# EAGLE schematic Main_f (EAGLE 6.4)
REV: 1.0
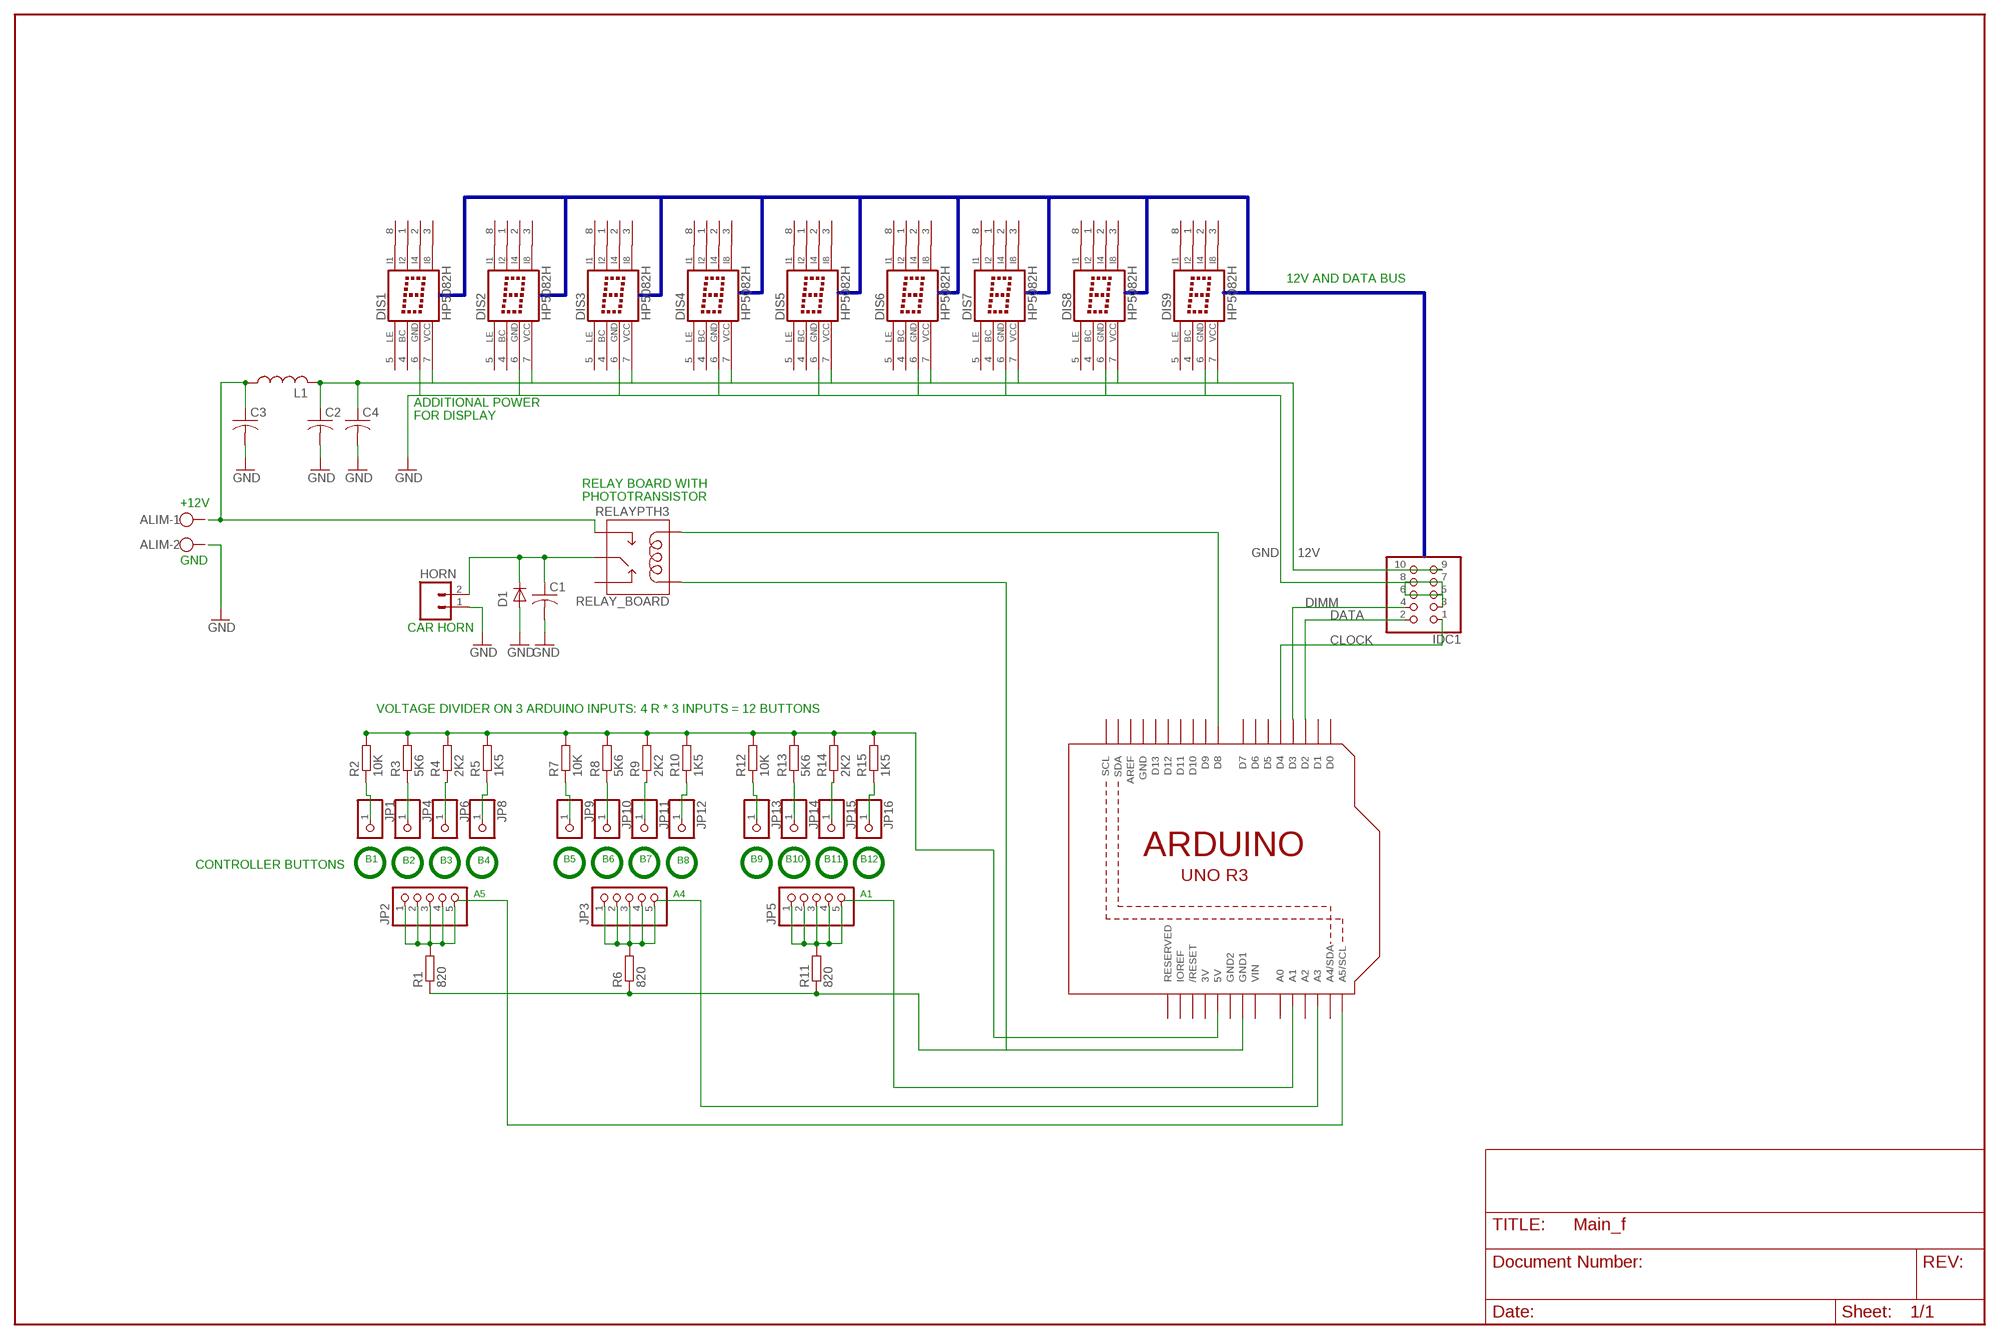
[diagram p0: schematic, sheet 1]

## Parts
ALIM  W237-102  [W237-102]
C1  C-US025-025X050  [C025-025X050]
C2  C-US025-025X050  [C025-025X050]
C3  C-US025-025X050  [C025-025X050]
C4  C-US025-025X050  [C025-025X050]
D1  DIODE1N400X  [1N400X]
DIS1  HP5082H  [HP5082]
DIS2  HP5082H  [HP5082]
DIS3  HP5082H  [HP5082]
DIS4  HP5082H  [HP5082]
DIS5  HP5082H  [HP5082]
DIS6  HP5082H  [HP5082]
DIS7  HP5082H  [HP5082]
DIS8  HP5082H  [HP5082]
DIS9  HP5082H  [HP5082]
HORN  M025MM  [SCREWTERMINAL-5MM-2]
IDC1  PINHD-2X5  [2X05]
JP1  PINHD-1X1  [1X01]
JP2  PINHD-1X5  [1X05]
JP3  PINHD-1X5  [1X05]
JP4  PINHD-1X1  [1X01]
JP5  PINHD-1X5  [1X05]
JP6  PINHD-1X1  [1X01]
JP8  PINHD-1X1  [1X01]
JP9  PINHD-1X1  [1X01]
JP10  PINHD-1X1  [1X01]
JP11  PINHD-1X1  [1X01]
JP12  PINHD-1X1  [1X01]
JP13  PINHD-1X1  [1X01]
JP14  PINHD-1X1  [1X01]
JP15  PINHD-1X1  [1X01]
JP16  PINHD-1X1  [1X01]
L1  INDUCTOR11R472C  [L2-5]
R1  820  R-EU_0207/12  [0207/12]
R2  10K  R-EU_0207/12  [0207/12]
R3  5K6  R-EU_0207/12  [0207/12]
R4  2K2  R-EU_0207/12  [0207/12]
R5  1K5  R-EU_0207/12  [0207/12]
R6  820  R-EU_0207/12  [0207/12]
R7  10K  R-EU_0207/12  [0207/12]
R8  5K6  R-EU_0207/12  [0207/12]
R9  2K2  R-EU_0207/12  [0207/12]
R10  1K5  R-EU_0207/12  [0207/12]
R11  820  R-EU_0207/12  [0207/12]
R12  10K  R-EU_0207/12  [0207/12]
R13  5K6  R-EU_0207/12  [0207/12]
R14  2K2  R-EU_0207/12  [0207/12]
R15  1K5  R-EU_0207/12  [0207/12]
RELAY_BOARD  RELAYPTH3  [RELAY-T9A-2]
U1  ARDUINOR3-DIMENSION  [ARDUINOR3]

## Nets
12V: C2.1 C4.1 DIS1.7(VCC) DIS2.7(VCC) DIS3.7(VCC) DIS4.7(VCC) DIS5.7(VCC) DIS6.7(VCC) DIS7.7(VCC) DIS8.7(VCC) DIS9.7(VCC) IDC1.9 IDC1.10 L1.2
A1: JP3.1 JP3.2 JP3.3 JP3.4 JP3.5 R6.2
A2: JP5.1 JP5.2 JP5.3 JP5.4 JP5.5 R11.2
A3: JP2.1 JP2.2 JP2.3 JP2.4 JP2.5 R1.2
B1: JP1.1 R2.1
B2: JP4.1 R3.1
B3: JP6.1 R4.1
B4: JP8.1 R5.1
B5: JP9.1 R7.1
B6: JP10.1 R8.1
B7: JP11.1 R9.1
B8: JP12.1 R10.1
B9: JP13.1 R12.1
B10: JP14.1 R13.1
B11: JP15.1 R14.1
B12: JP16.1 R15.1
CLOCK: IDC1.1 U1.D4
DATA: IDC1.2 U1.D2
DIMM: IDC1.4 U1.D3
GND: C1.2 C2.2 C3.2 C4.2 D1.A DIS1.6(GND) DIS2.6(GND) DIS3.6(GND) DIS4.6(GND) DIS5.6(GND) DIS6.6(GND) DIS7.6(GND) DIS8.6(GND) DIS9.6(GND) HORN.1 IDC1.3 IDC1.5 IDC1.6 IDC1.7 IDC1.8
GND1: R1.1 R6.1 R11.1 RELAY_BOARD.COIL1 U1.GND1
N$1: C1.1 D1.K HORN.2 RELAY_BOARD.MAIN
N$2: RELAY_BOARD.COIL2
N$11: C3.1 L1.1 RELAY_BOARD.NO
VCC: R2.2 R3.2 R4.2 R5.2 R7.2 R8.2 R9.2 R10.2 R12.2 R13.2 R14.2 R15.2
Unconnected: ALIM.1 ALIM.2 DIS1.1(I2) DIS1.2(I4) DIS1.3(I8) DIS1.4(BC) DIS1.5(LE) DIS1.8(I1) DIS2.1(I2) DIS2.2(I4) DIS2.3(I8) DIS2.4(BC) DIS2.5(LE) DIS2.8(I1) DIS3.1(I2) DIS3.2(I4) DIS3.3(I8) DIS3.4(BC) DIS3.5(LE) DIS3.8(I1) DIS4.1(I2) DIS4.2(I4) DIS4.3(I8) DIS4.4(BC) DIS4.5(LE) DIS4.8(I1) DIS5.1(I2) DIS5.2(I4) DIS5.3(I8) DIS5.4(BC) DIS5.5(LE) DIS5.8(I1) DIS6.1(I2) DIS6.2(I4) DIS6.3(I8) DIS6.4(BC) DIS6.5(LE) DIS6.8(I1) DIS7.1(I2) DIS7.2(I4) DIS7.3(I8) DIS7.4(BC) DIS7.5(LE) DIS7.8(I1) DIS8.1(I2) DIS8.2(I4) DIS8.3(I8) DIS8.4(BC) DIS8.5(LE) DIS8.8(I1) DIS9.1(I2) DIS9.2(I4) DIS9.3(I8) DIS9.4(BC) DIS9.5(LE) DIS9.8(I1) RELAY_BOARD.NC U1.A0 U1.A1 U1.A2 U1.A3 U1.A4(A4/SDA) U1.A5(A5/SCL) U1.AREF U1.D0 U1.D1 U1.D5 U1.D6 U1.D7 U1.D8 U1.D9 U1.D10 U1.D11 U1.D12 U1.D13 U1.IOREF U1.RESERVED U1.RESET(/RESET) U1.SCL U1.SDA

## Buses
B$1
B$2

## Notes on the sheet
- 12V AND DATA BUS
- ADDITIONAL POWER
  FOR DISPLAY
- RELAY BOARD WITH
  PHOTOTRANSISTOR
- +12V
- GND
- CAR HORN
- VOLTAGE DIVIDER ON 3 ARDUINO INPUTS: 4 R * 3 INPUTS = 12 BUTTONS
- B1 | B2 | B3 | B4 | B5 | B6 | B7 | B8 | B9 | B10 | B11 | B12
- CONTROLLER BUTTONS
- A5 | A4 | A1

## Power pins joined to a net without a drawn wire
3V: U1.3V
5V: U1.5V
GND: U1.GND
GND2: U1.GND2
VIN: U1.VIN

## Library data of the parts
ALIM = con-wago-500:W237-102: WAGO SCREW CLAMP; MPN: 237-102; OC_FARNELL: unknown; OC_NEWARK: 70K9898
C1-C4 = _jc:C-US: CAPACITOR, American symbol
D1 = _jc:DIODE
DIS1-DIS9 = display-hp:HP5082H: LED DISPLAY 1-character dot matrix, 2 decimal points; OC_FARNELL: unknown; OC_NEWARK: unknown
HORN = SparkFun:M02: Header 2 Standard 2-pin 0.1" header. Use with straight break away headers (SKU : PRT-00116), right angle break away headers (PRT-00553), swiss pins (PRT-00743), machine pins (PRT-00117), and female headers (PRT-00115). Molex polarized connector foot print use with SKU : PRT-08233 with associated crimp pins and housings.
IDC1 = pinhead:PINHD-2X5: PIN HEADER
JP1 JP4 JP6 JP8-JP16 = pinhead:PINHD-1X1: PIN HEADER
JP2 JP3 JP5 = pinhead:PINHD-1X5: PIN HEADER
L1 = _jc:INDUCTOR: Murata #11R472C
R1-R15 = resistor:R-EU_: RESISTOR, European symbol
RELAY_BOARD = SparkFun:RELAY
U1 = adafruit:ARDUINOR3: This is a new object for the new Arduino R3 - with extra pins that you may want to use (such as IOref, and duplicated A4/A5

## Net classes
0 default: width 0.254 mm, drill 0.254 mm, clearance 0.305 mm